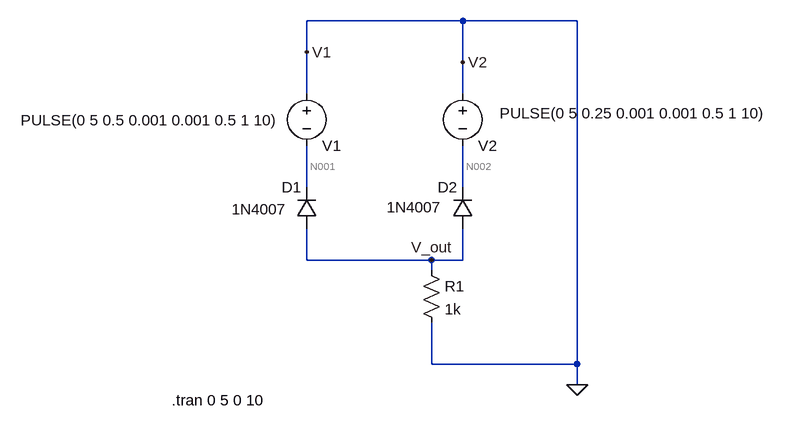
[diagram p0: schematic Porte_logique_non_Diode.asc]
Porte_logique_non_Diode.asc, the LTspice schematic file:
Version 4.1
SHEET 1 880 680
WIRE 288 -160 48 -160
WIRE 464 -160 288 -160
WIRE 48 -112 48 -160
WIRE 288 -96 288 -160
WIRE 48 -48 48 -112
WIRE 288 -48 288 -96
WIRE 48 96 48 32
WIRE 288 96 288 32
WIRE 48 208 48 160
WIRE 240 208 48 208
WIRE 288 208 288 160
WIRE 288 208 240 208
WIRE 240 224 240 208
WIRE 240 368 240 304
WIRE 464 368 464 -160
WIRE 464 368 240 368
WIRE 464 400 464 368
FLAG 464 400 0
FLAG 48 -112 V1
FLAG 288 -96 V2
FLAG 240 208 V_out
SYMBOL res 224 208 R0
SYMATTR InstName R1
SYMATTR Value 1k
SYMBOL diode 304 160 R180
WINDOW 0 24 64 Left 2
WINDOW 3 48 33 Left 2
SYMATTR InstName D2
SYMATTR Value 1N4007
SYMBOL diode 64 160 R180
WINDOW 0 24 64 Left 2
WINDOW 3 47 30 Left 2
SYMATTR InstName D1
SYMATTR Value 1N4007
SYMBOL voltage 48 -64 R0
WINDOW 0 24 96 Left 2
WINDOW 3 -440 57 Left 2
WINDOW 123 0 0 Left 0
WINDOW 39 0 0 Left 0
SYMATTR InstName V1
SYMATTR Value PULSE(0 5 0.5 0.001 0.001 0.5 1 10)
SYMBOL voltage 288 -64 R0
WINDOW 0 24 96 Left 2
WINDOW 3 57 46 Left 2
WINDOW 123 0 0 Left 0
WINDOW 39 0 0 Left 0
SYMATTR InstName V2
SYMATTR Value PULSE(0 5 0.25 0.001 0.001 0.5 1 10)
TEXT -160 424 Left 2 !.tran 0 5 0 10

The netlist it stands for:
* Porte_logique_non_Diode.asc
R1 V_out 0 1k
D2 V_out N002 1N4007
D1 V_out N001 1N4007
V1 0 N001 PULSE(0 5 0.5 0.001 0.001 0.5 1 10)
V2 0 N002 PULSE(0 5 0.25 0.001 0.001 0.5 1 10)
.model D D
.lib standard.dio
.tran 0 5 0 10
.backanno
.end

* Results of the author's LTspice run, read from the files saved beside the schematic
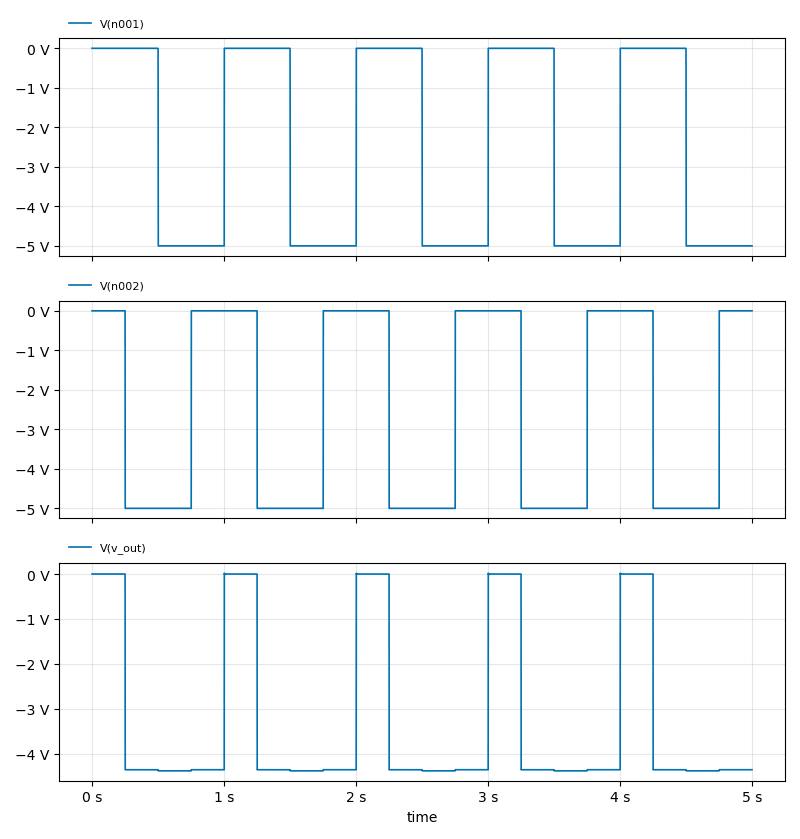
[diagram p1: Transient Analysis of Porte_logique_non_Diode.asc, plotted from the saved traces]
* Transient Analysis, 1 run:
*   V(n001): min -5 V, max 0 V, average -2.504 V, rms 3.537 V, last -5 V
*   V(n002): min -5 V, max 0 V, average -2.505 V, rms 3.538 V, last 0 V
*   V(v_out): min -4.384 V, max 15.63 mV, average -3.278 V, rms 3.783 V, last -4.359 V